# EAGLE design Tiefenentladeschutz-ohneLed (EAGLE 8.0.1)
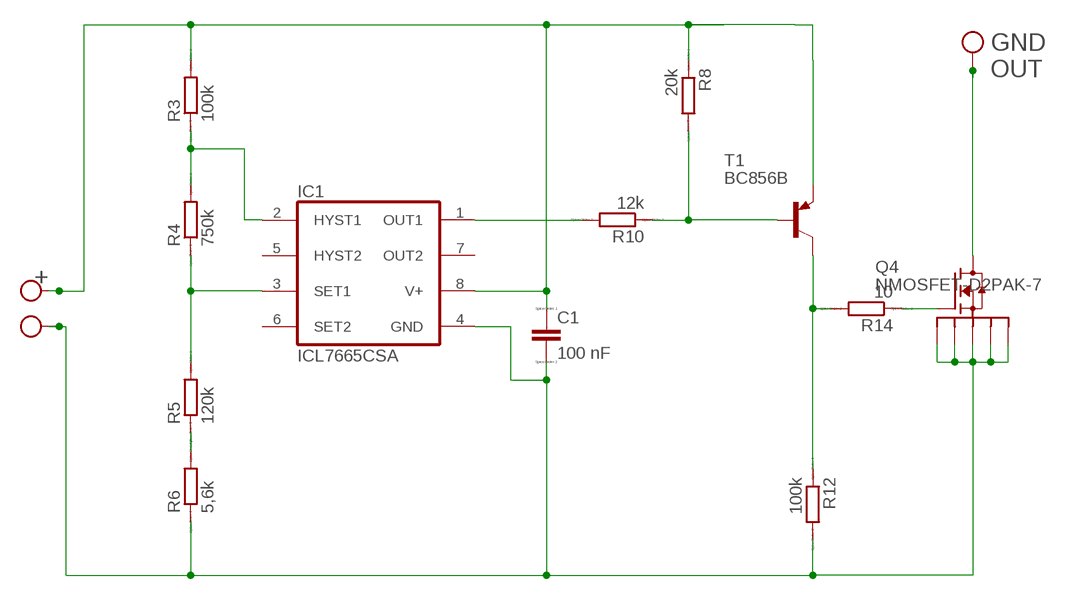
[diagram p0: schematic, sheet 1]

## Parts
C1  100 nF  CC1206  [C1206]
IC1  ICL7665CSA  [SO08]
Q4  NMOSFET-D2PAK-7  [H2PAK-6]
R3  100k  RR1206  [R1206]
R4  750k  RR1206  [R1206]
R5  120k  RR1206  [R1206]
R6  5,6k  RR1206  [R1206]
R8  20k  RR1206  [R1206]
R10  12k  RR1206  [R1206]
R12  100k  RR1206  [R1206]
R14  10  RR1206  [R1206]
T1  BC856B  BC856B-PNP-SOT23-BEC  [SOT23-BEC]
U$4  PIN2.54  [PIN]
U$6  PIN1.27  [PIN-1.27]
U$7  PIN1.27  [PIN-1.27]

## Nets
GND: C1.2 IC1.4(GND) Q4.S1 Q4.S2 Q4.S3 Q4.S4 Q4.S5 R6.1 R12.2 U$6.P$1
N$1: Q4.D U$7.P$1
N$2: IC1.3(SET1) R4.1 R5.2
N$7: R8.2 R10.1 T1.B
N$12: Q4.G R14.1
N$13: IC1.2(HYST1) R3.1 R4.2
N$16: IC1.1(OUT1) R10.2
N$22: R12.1 R14.2 T1.C
N$26: R5.1 R6.2
V+: C1.1 IC1.8(V+) R3.2 R8.1 T1.E U$4.P$1
Unconnected: IC1.5(HYST2) IC1.6(SET2) IC1.7(OUT2)

## Notes on the sheet
- GND 
  OUT
- +

## Library data of the parts
C1 = eagle-ltspice:C: CAPACITOR, European symbol; SPICEMODEL: NONE; SPICEPREFIX: C
IC1 = maxim:ICL7665CSA: UNDER/OVER VOLTAGE DETECTOR; MPN: ICL7665CSA+; OC_FARNELL: unknown; OC_NEWARK: 19M9537
Q4 = D2pak-7:NMOSFET-D2PAK-7
R3-R6 R8 R10 R12 R14 = eagle-ltspice:R: RESISTOR, European symbol; SPICEMODEL: NONE; SPICEPREFIX: R
T1 = transistor:*-PNP-: PNP Transistror
U$4 U$6 U$7 = 0liver:PIN

## Board
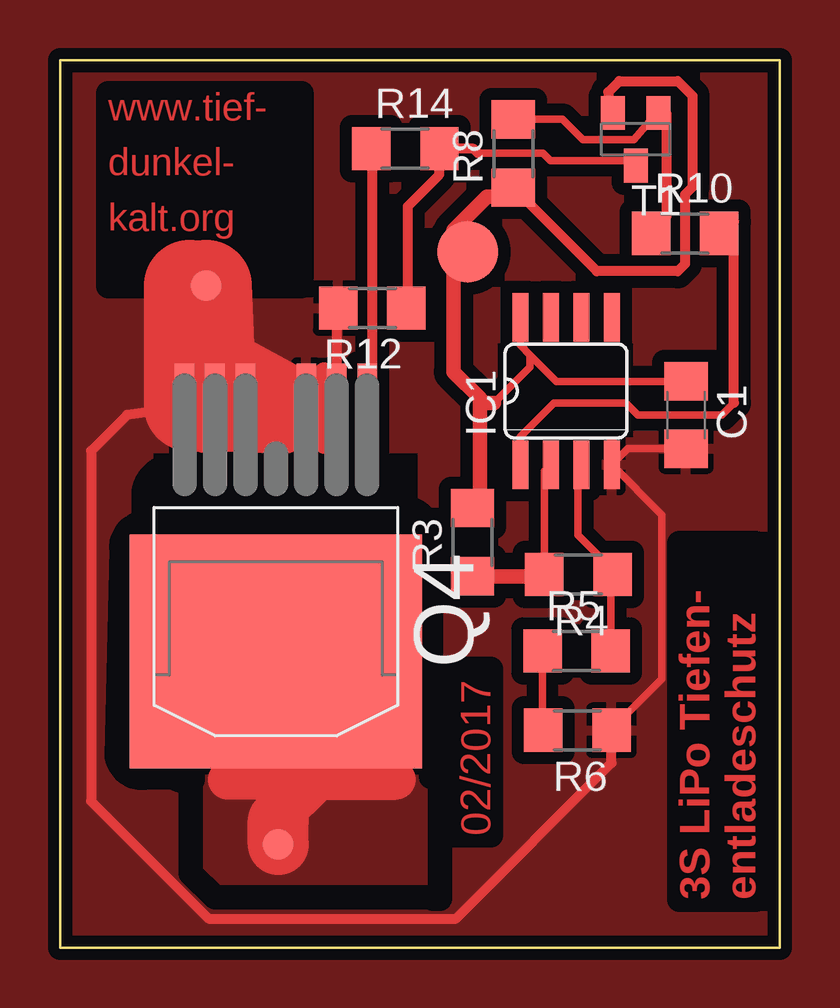
[diagram p1: board, top side]

Size 30 x 37 mm. Coordinates in mm from the lower left corner, seen from the top.
Outline: 0,0 0,37 30,37 30,0 0,0
Copper layers (1*16): Top 0.035mm / dielectric 1.5mm / Bottom 0.035mm
Design rules "default *": minimum track width 14mil, minimum drill 24mil, track to track 20mil, track to pad 20mil, pad to pad 20mil, via to via 20mil, smd to smd 8mil, copper to edge 18mil, drill to drill 18mil, minimum pad ring 10mil, minimum via ring 8mil, stop-mask expansion 4mil, vias tented up to drill 0mil, thermal gap 10mil
tRestrict: area 3.9,15.7 to 14.9,20.6; area 18.3,21.3 to 23.9,25.2; 18 lines

### Footprints (pad centres in the part's own frame; a part is rotated, then mirrored left to right if it is on the bottom)
C1206 = smd 1.6 x 1.8: 1 -1.4,0; 2 1.4,0
SO08 = smd 0.66 x 2.032: 1 -1.905,-3.073; 2 -0.635,-3.073; 3 0.635,-3.073; 4 1.905,-3.073; 5 1.905,3.073; 6 0.635,3.073; 7 -0.635,3.073; 8 -1.905,3.073
H2PAK-6 = smd 12.2 x 9.75: D 0,1.56 | smd 0.8 x 3.5: G -3.81,-8.7; S1 -2.54,-8.7; S2 -1.27,-8.7; S3 1.27,-8.7; S4 2.54,-8.7; S5 3.81,-8.7
R1206 = smd 1.6 x 1.803: 1 -1.422,0; 2 1.422,0
SOT23-BEC = smd 1 x 1.4: B -0.95,-1.1; C 0,1.1; E 0.95,-1.1
PIN = smd 2.54 x 2.54: P$1 0,0
PIN-1.27 = smd 1.27 x 1.27: P$1 0,0

### Placement (x,y rotation side)
C1  26.1,22.2 270 top
IC1  21.1,23.2 0 top
Q4  9,13.9 180 top
R3  17.2,16.9 90 top
R4  21.62,15.55 180 top
R5  21.54,12.36 0 top
R6  21.57,9.06 180 top
R8  18.9,33.1 90 top
R10  26.06,29.77 0 top
R12  13.02,26.66 180 top
R14  14.4,33.3 0 top
T1  24,33.7 180 top
U$4  17,29 0 top
U$6  6.1,27.6 0 top
U$7  9.1,4.3 0 top

### Tracks (layer width: path | path; a pad name or v marks a point on that pad's centre or on a via)
FILL
  pour Top: -4,42 42,42 42,-4 -4,-4
GND
  Top 0.305: 26.2,20.7 C1.2 23.68,20.8 IC1.4 25.1,18.03 25.1,11.2 22.99,9.09 R6.1 | 9.1,22.43 7.47,20.6
  Top 0.406: Q4.S5 5.4,22.6 6.4,22.6 Q4.S4 | Q4.S4 Q4.S3 | Q4.S4 7.5,22.6 7.6,23.5 10.17,23.5 Q4.S2 10.3,22.6 10.4,22.5 10.44,22.5 | 10.44,22.5 Q4.S1 | R12.2 11.54,26.66 Q4.S1 | Q4.S1 10.44,22.5 | 10.44,22.5 10.14,23.2 2.8,22.2 1.3,20.7 1.3,6.1 6.2,1.2 16.5,1.2 22.99,7.69 R6.1 | 6.3,22.5 7.8,24 11,24
  Top 0.813: 11,24 11,21 10,22 9,22 9,22.33 9.1,22.43
  Top 3.81: 6.3,22.5 U$6.P$1 | 5.4,27.6 5.4,22.6 6.6,23.9 9.2,22.5 6.4,22.6
  pour Top: -3,40 -2.78,-2.15 33.76,-2.01 33.5,40
N$1
  Top 1.676: 9.1,5.3 10.8,7 14,7 7,7 9,9 Q4.D
  Top 2.54: U$7.P$1 9.1,5.3
  pour Top: 6.1,7.2 6.6,7.7 15,7.7 15.4,7.3 15.4,2.7 15.3,2.6 6.8,2.6 6.1,3.3
N$2
  Top 0.305: IC1.3 21.6,19.99 21.6,17.2 23.04,15.76 R4.1 22.96,15.47 R5.2
N$7
  Top 0.305: T1.B 24.95,34.86 23.93,33.68 21.79,33.68 20.95,34.52 R8.2
  Top 0.406: R10.1 25.3,30.49 25.3,34.75 T1.B
N$12
  Top 0.406: R14.1 13.02,33.26 13.02,25.26 13.02,22.81 Q4.G
N$13
  Top 0.305: IC1.2 20.19,19.86 R4.2
  Top 0.61: R4.2 20.12,15.48 R3.1
N$14
  pour Top (no thermals): 10.12,23.56 10.68,23.56 10.68,21.15 10.12,21.15
N$16
  Top 0.305: 28.1,22.7 27.6,22.2 24.1,22.2 23.6,22.7 20.6,22.7 19.2,21.3 IC1.1
  Top 0.406: 28.1,22.7 28.1,30.24 R10.2
N$22
  Top 0.305: 17.42,33.12 20.13,33.12 20.45,32.8 23.8,32.8 T1.C
  Top 0.406: 14.4,26.62 R12.1 | 17.42,33.12 17.3,33.24 17.24,33.3 R14.2 15.82,32.22 14.5,30.9 14.5,26.72 R12.1 | 14.5,26.1 14.5,26.6 R12.1
N$26
  Top 0.305: R6.2 20.12,9.09 R5.1
V+
  Top 0.305: 25.5,24.2 C1.1 20.7,23.6 19.6,24.7 | 19.1,26.37 IC1.8 19.2,25.11 19.6,24.7 | 18.1,22.7 19.6,24.2 19.6,24.7 | R8.1 18.42,31.3
  Top 0.406: 16.4,29.9 17,29.3 U$4.P$1 | T1.E 22.86,35.29 22.86,35.66 23.32,36.12 25.76,36.12 26.36,35.51 26.36,31.7 26.06,31.39 26.06,28.5 25.76,28.19 22.38,28.19 R8.1
  Top 0.61: 18.42,31.3 17.8,31.3 16.4,29.9 16.4,24 17.5,22.9 | 17.5,22.9 17.7,22.7 18.1,22.7 | R3.2 17.5,18.62 17.5,22.9

### Text on the board
Top: Tiefenentladeschutz ohne Led V1.0 10/2016 | Mosfet STH270N4F3-6 | www.tief- / dunkel- / kalt.org | 02/2017 | 3S LiPo Tiefen- / entladeschutz